# EAGLE design ATTiny84-RFM95W-BME280 (EAGLE 9.5.2)
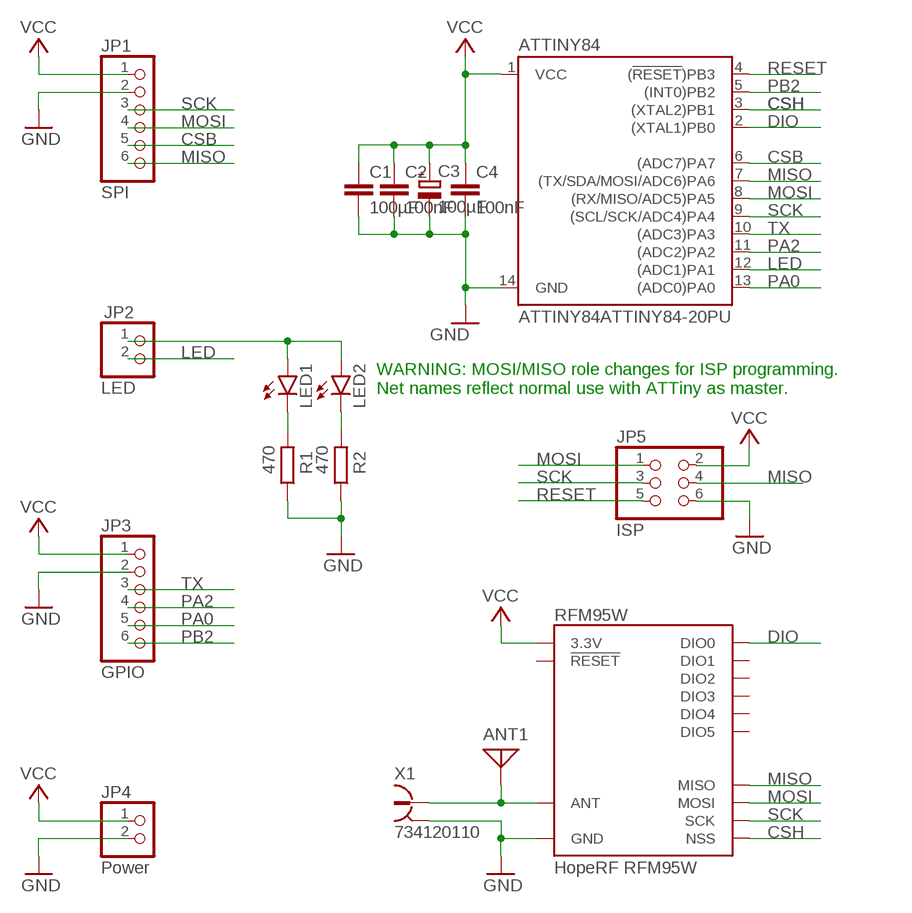
[diagram p0: schematic, sheet 1]

## Parts
ANT1  ANTENNA  [PAD-01]
ATTINY84  ATTINY84ATTINY84-20PU  [DIP14]
C1  100µF  C-EUC0805  [C0805]
C2  100nF  C-EUC0805  [C0805]
C3  100µF  CPOL-EUE2.5-6  [E2,5-6]
C4  100nF  C-EU050-050X075  [C050-050X075]
JP1  SPI  PINHD-1X6  [1X06]
JP2  LED  PINHD-1X2  [1X02]
JP3  GPIO  PINHD-1X6  [1X06]
JP4  Power  PINHD-1X2  [1X02]
JP5  ISP  PINHD-2X3  [2X03]
LED1  LEDCHIP-LED0805  [CHIP-LED0805]
LED2  LED3MM  [LED3MM]
R1  470  R-EU_R0805  [R0805]
R2  470  R-EU_0207/12  [0207/12]
RFM95W  RFM95W  [RFM95/96/97/98W]
X1  734120110  [734120110]

## Nets
CSB: ATTINY84.6((ADC7)PA7) JP1.5
CSH: ATTINY84.3((XTAL2)PB1) RFM95W.NSS
DIO: ATTINY84.2((XTAL1)PB0) RFM95W.DIO0
GND: ATTINY84.14(GND) C1.2 C2.2 C3.- C4.2 JP1.2 JP3.2 JP4.2 JP5.6 R1.1 R2.1 RFM95W.GND@1(GND) RFM95W.GND@2(GND) RFM95W.GND@3(GND) X1.S@1 X1.S@2 X1.S@3
LED: ATTINY84.12((ADC1)PA1) JP2.2
MISO: ATTINY84.7((TX/SDA/MOSI/ADC6)PA6) JP1.6 JP5.4 RFM95W.MISO
MOSI: ATTINY84.8((RX/MISO/ADC5)PA5) JP1.4 JP5.1 RFM95W.MOSI
N$1: ANT1.1 RFM95W.ANT X1.1
N$3: LED1.C R1.2
N$4: LED2.K(C) R2.2
N$7: JP2.1 LED1.A LED2.A
PA0: ATTINY84.13((ADC0)PA0) JP3.5
PA2: ATTINY84.11((ADC2)PA2) JP3.4
PB2: ATTINY84.5((INT0)PB2) JP3.6
RESET: ATTINY84.4((!RESET!)PB3) JP5.5
SCK: ATTINY84.9((SCL/SCK/ADC4)PA4) JP1.3 JP5.3 RFM95W.SCK
TX: ATTINY84.10((ADC3)PA3) JP3.3
VCC: ATTINY84.1(VCC) C1.1 C2.1 C3.+ C4.1 JP1.1 JP3.1 JP4.1 JP5.2 RFM95W.3.3V
Unconnected: RFM95W.!RESET RFM95W.DIO1 RFM95W.DIO2 RFM95W.DIO3 RFM95W.DIO4 RFM95W.DIO5

## Notes on the sheet
- WARNING: MOSI/MISO role changes for ISP programming. 
  Net names reflect normal use with ATTiny as master.

## Library data of the parts
ANT1 = discrete:ANTENNA: Antenna
ATTINY84 = SparkFun-IC-Microcontroller:ATTINY84: Atmel 14-pin 2/4/8kB flash uC Datasheet <https://cdn.sparkfun.com/datasheets/Widgets/doc8006.pdf> SparkFun Products Tiny AVR Programmer <https://www.sparkfun.com/products/11801> (PGM-11801) SparkFun Servo Trigger - Continuous Rotation <https://www.sparkfun.com/products/13872> (WIG-13872) SparkFun Servo Trigger <https://www.sparkfun.com/products/13118> (WIG-13118)
C1 C2 C4 = rcl:C-EU: CAPACITOR, European symbol; SPICEPREFIX: C
C3 = rcl:CPOL-EU: POLARIZED CAPACITOR, European symbol; SPICEPREFIX: C
JP1 JP3 = pinhead:PINHD-1X6: PIN HEADER
JP2 JP4 = pinhead:PINHD-1X2: PIN HEADER
JP5 = pinhead:PINHD-2X3: PIN HEADER
LED1 LED2 = led:LED: LED OSRAM: - CHIPLED LG R971, LG N971, LY N971, LG Q971, LY Q971, LO R971, LY R971 LH N974, LH R974 LS Q976, LO Q976, LY Q976 LO Q996 - Hyper CHIPLED LW Q18S LB Q993, LB Q99A, LB R99A - SideLED LS A670, LO A670, LY A670, LG A670, LP A670 LB A673, LV A673, LT A673, LW A673 LH A674 LY A675 LS A676, LA A676, LO A676, LY A676, LW A676 LS A679, LY A679, LG A679 - Hyper Micro SIDELED® LS Y876, LA Y876, LO Y876, LY Y876 LT Y87S - SmartLED LW L88C, LW L88S LB L89C, LB L89S, LG L890 LS L89K, LO L89K, LY L89K LS L896, LA L896, LO L896, LY L896 - TOPLED LS T670, LO T670, LY T670, LG T670, LP T670 LSG T670, LSP T670, LSY T670, LOP T670, LYG T670 LG T671, LOG T671, LSG T671 LB T673, LV T673, LT T673, LW T673 LH T674 LS T676, LA T676, LO T676, LY T676, LB T676, LH T676, LSB T676, LW T676 LB T67C, LV T67C, LT T67C, LS T67K, LO T67K, LY T67K, LW E67C LS E67B, LA E67B, LO E67B, LY E67B, LB E67C, LV E67C, LT E67C LW T67C LS T679, LY T679, LG T679 LS T770, LO T770, LY T770, LG T770, LP T770 LB T773, LV T773, LT T773, LW T773 LH T774 LS E675, LA E675, LY E675, LS T675 LS T776, LA T776, LO T776, LY T776, LB T776 LHGB T686 LT T68C, LB T68C - Hyper Mini TOPLED® LB M676 - Mini TOPLED Santana® LG M470 LS M47K, LO M47K, LY M47K Source: http://www.osram.convergy.de LUXEON: - LUMILED® LXK2-PW12-R00, LXK2-PW12-S00, LXK2-PW14-U00, LXK2-PW14-V00 LXK2-PM12-R00, LXK2-PM12-S00, LXK2-PM14-U00 LXK2-PE12-Q00, LXK2-PE12-R00, LXK2-PE12-S00, LXK2-PE14-T00, LXK2-PE14-U00 LXK2-PB12-K00, LXK2-PB12-L00, LXK2-PB12-M00, LXK2-PB14-N00, LXK2-PB14-P00, LXK2-PB14-Q00 LXK2-PR12-L00, LXK2-PR12-M00, LXK2-PR14-Q00, LXK2-PR14-R00 LXK2-PD12-Q00, LXK2-PD12-R00, LXK2-PD12-S00 LXK2-PH12-R00, LXK2-PH12-S00 LXK2-PL12-P00, LXK2-PL12-Q00, LXK2-PL12-R00 Source: www.luxeon.com KINGBRIGHT: KA-3528ASYC Source: www.kingbright.com
R1 R2 = rcl:R-EU_: RESISTOR, European symbol; SPICEPREFIX: R
RFM95W = SparkFun-RF:RFM95W: RFM95/96/97/98 The RFM95/96/97/98(W) transceivers feature the LoRaTM long range modem that provides ultra-long range spread spectrum communication and high interference immunity whilst minimising current consumption. These devices also support high performance (G)FSK modes for systems including WMBus, IEEE802.15.4g. The RFM95/96/97/98(W) deliver exceptional phase noise, selectivity, receiver linearity and IIP3 for significantly lower current consumption than competing devices Datasheet <http://www.hoperf.com/upload/rf/RFM95_96_97_98W.pdf>; PROD_ID: IC-13959; PROD_NAME: HopeRF RFM95W
X1 = con-coax:734120110: MICRO COAXIAL CONNECTOR RECEPTACLE VERTICAL Source: Data sheet <http://www.molex.com/pdm_docs/sd/734120110_sd.pdf>

## Board
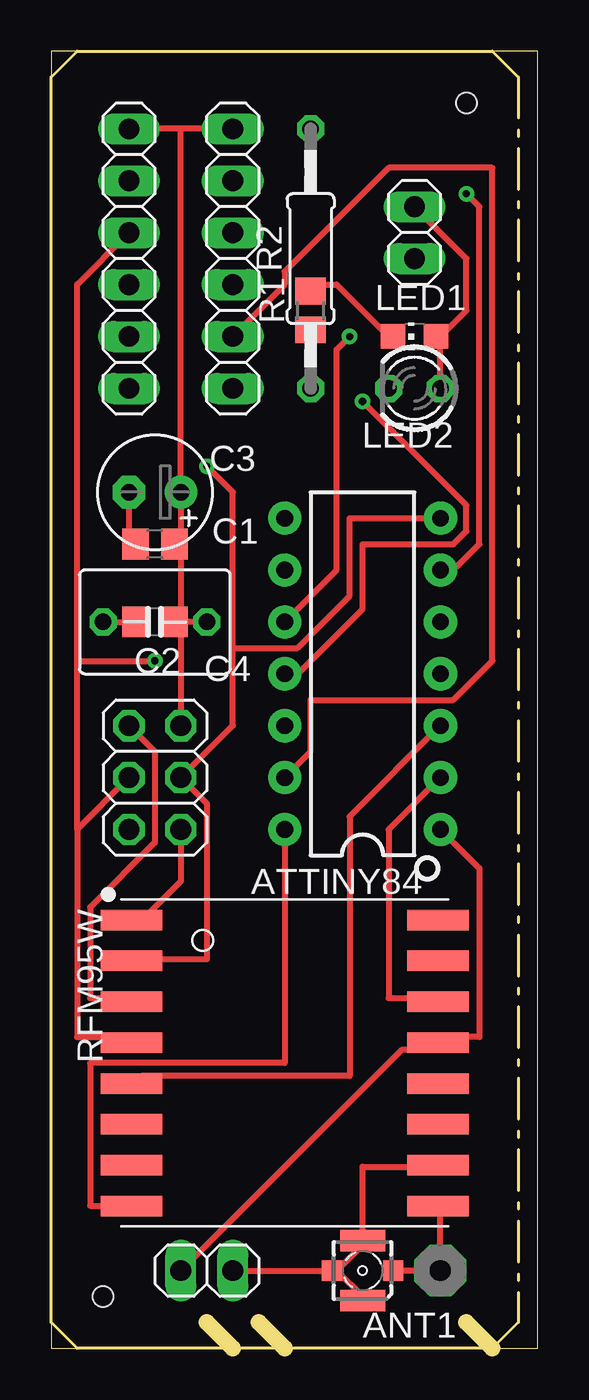
[diagram p1: board, top side]
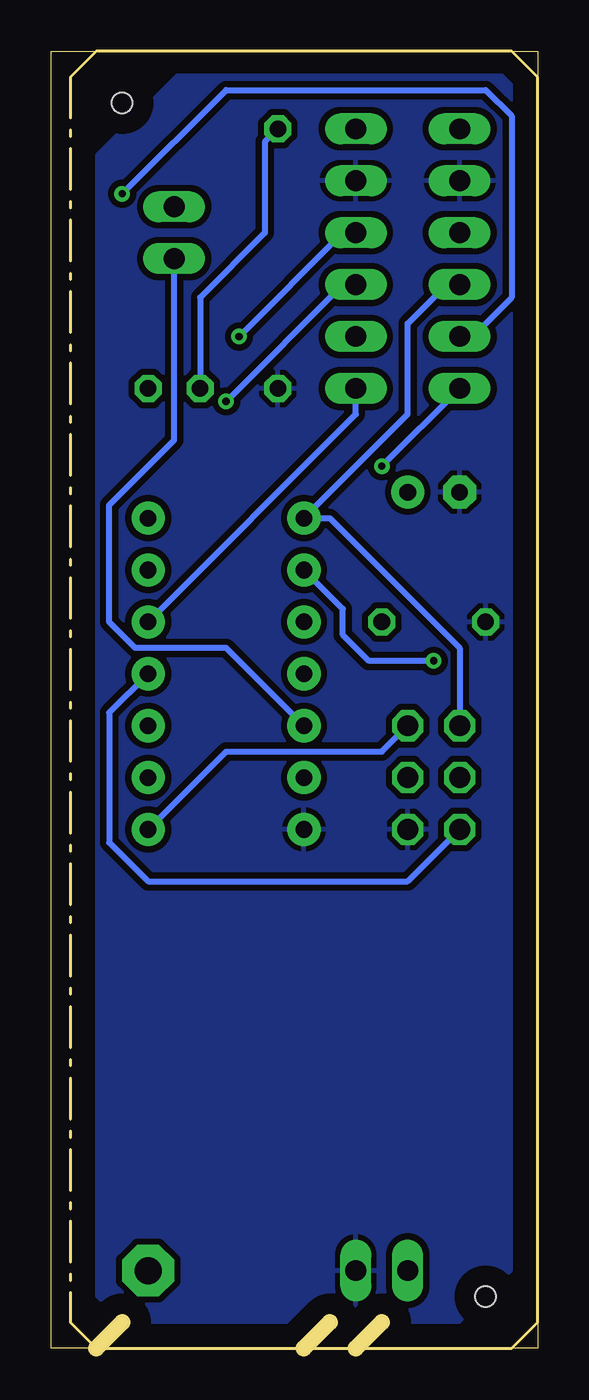
[diagram p2: board, bottom side, seen from below]

Size 23.8 x 63.5 mm. Coordinates in mm from the lower left corner, seen from the top.
Outline: 1.27,0 0,0 0,1.27
Outline: 1.27,0 8.89,0
Outline: 8.89,0 11.43,0
Outline: 11.43,0 21.59,0
Outline: 21.59,0 23.8,0 23.8,63.49 0,63.49 0,62.23
Outline: 7.62,1.27 8.89,0
Outline: 10.16,1.27 11.43,0
Outline: 20.32,1.27 21.59,0
Outline: 21.59,0 22.86,1.27 22.86,62.23 21.59,63.5 1.27,63.5 0,62.23
Outline: 21.59,0 1.27,0
Outline: 1.27,0 0,1.27
Outline: 0,1.27 0,62.23
Copper layers (1*16): Top 0.035mm / dielectric 1.5mm / Bottom 0.035mm
Design rules "default *": minimum track width 12mil, minimum drill 0.35mm, track to track 12mil, track to pad 12mil, pad to pad 12mil, via to via 12mil, smd to smd 6mil, copper to edge 40mil, drill to drill 6mil, minimum pad ring 10mil, minimum via ring 8mil, stop-mask expansion 4mil, vias tented up to drill 0mil, thermal gap 10mil
Holes 1 mm at 2.54,2.54 20.32,60.96

### Footprints (pad centres in the part's own frame; a part is rotated, then mirrored left to right if it is on the bottom)
PAD-01 = drill 1.321 pad 2.54 octagon: 1 0,0
DIP14 = drill 0.813 pad 1.626: 1 -7.62,-3.81; 2 -5.08,-3.81; 3 -2.54,-3.81; 4 0,-3.81; 5 2.54,-3.81; 6 5.08,-3.81; 7 7.62,-3.81; 8 7.62,3.81; 9 5.08,3.81; 10 2.54,3.81; 11 0,3.81; 12 -2.54,3.81; 13 -5.08,3.81; 14 -7.62,3.81
C0805 = smd 1.3 x 1.5: 1 -0.95,0; 2 0.95,0
E2,5-6 = drill 0.813 pad 1.6: + -1.27,0 | drill 0.813 pad 1.6 octagon: - 1.27,0
C050-050X075 = drill 0.813 octagon: 1 -2.54,0; 2 2.54,0
1X06 = drill 1.016 long: 1 -6.35,0; 2 -3.81,0; 3 -1.27,0; 4 1.27,0; 5 3.81,0; 6 6.35,0
1X02 = drill 1.016 long: 1 -1.27,0; 2 1.27,0
2X03 = drill 1.016 octagon: 1 -2.54,-1.27; 2 -2.54,1.27; 3 0,-1.27; 4 0,1.27; 5 2.54,-1.27; 6 2.54,1.27
CHIP-LED0805 = smd 1.2 x 1.2: A 0,-1.05; C 0,1.05
LED3MM = drill 0.813 octagon: A -1.27,0; K 1.27,0
R0805 = smd 1.3 x 1.5: 1 -0.95,0; 2 0.95,0
0207/12 = drill 0.813 octagon: 1 -6.35,0; 2 6.35,0
RFM95/96/97/98W = smd 3 x 1: 3.3V 7.5,1; !RESET -7.5,-3; ANT 7.5,-7; DIO0 7.5,3; DIO1 7.5,5; DIO2 7.5,7; DIO3 7.5,-3; DIO4 7.5,-1; DIO5 -7.5,-5; GND@1 -7.5,7; GND@2 -7.5,-7; GND@3 7.5,-5; MISO -7.5,5; MOSI -7.5,3; NSS -7.5,-1; SCK -7.5,1
734120110 = smd 1 x 1: 1 0,-1.5; S@1 0,1.5 | smd 1.05 x 2.2: S@2 -1.475,0; S@3 1.475,0

### Placement (x,y rotation side)
ANT1  19.05,3.81 0 top
ATTINY84  15.24,33.02 90 top
C1  5.08,39.37 180 top
C2  5.08,35.56 180 top
C3  5.08,41.91 180 top
C4  5.08,35.56 180 top
JP1  3.81,53.34 270 top
JP2  17.78,54.61 270 top
JP3  8.89,53.34 270 top
JP4  7.62,3.81 0 top
JP5  5.08,27.94 270 top
LED1  17.78,49.53 90 top
LED2  17.78,46.99 180 top
R1  12.7,50.8 90 top
R2  12.7,53.34 90 top
RFM95W  11.43,13.97 0 top
X1  15.24,3.81 90 top

### Tracks (layer width: path | path; a pad name or v marks a point on that pad's centre or on a via)
CSB  (via drill 0.35)
  Top 0.305: v20.32,56.52 20.95,55.88 20.95,39.37 19.68,38.1 ATTINY84.6
  Bottom 0.305: JP1.5 3.17,49.53 1.27,51.44 1.27,60.33 2.54,61.59 15.24,61.59 v20.32,56.52
CSH
  Top 0.305: ATTINY84.3 14.61,26.04 14.61,13.34 4.45,13.34 RFM95W.NSS
DIO
  Top 0.305: ATTINY84.2 16.51,25.4 16.51,17.14 18.41,17.14 RFM95W.DIO0
GND
  Top 0.305: 13.97,3.81 15.24,5.08 X1.S@3 15.24,8.89 18.41,8.89 RFM95W.GND@3 | 13.97,3.81 15.24,2.54 X1.S@2 | 13.97,3.81 X1.S@1 JP4.2 | C4.2 C2.2 | C3.- 3.81,39.37 C1.2 | R2.1 R1.1 | ATTINY84.14 11.43,13.97 1.91,13.97 1.91,6.99 3.81,6.99 RFM95W.GND@2 | JP5.6 6.35,22.86 4.45,20.95 RFM95W.GND@1
  pour Bottom: 1.27,63.5 16.51,63.5 21.59,58.42 21.59,2.54 20.32,1.27 3.81,1.27 1.27,3.81
LED
  Bottom 0.305: JP2.2 17.78,44.45 20.95,41.27 20.95,35.56 19.68,34.29 15.24,34.29 ATTINY84.12
MISO  (via drill 0.35)
  Top 0.305: RFM95W.MISO 4.45,19.05 7.62,19.05 7.62,26.67 JP5.4 8.89,30.48 8.89,34.29 | v7.62,43.18 8.89,41.91 8.89,34.29 | ATTINY84.7 14.61,40.64 14.61,36.83 12.06,34.29 8.89,34.29
  Bottom 0.305: v7.62,43.18 JP1.6
MOSI
  Top 0.305: JP5.1 5.08,29.21 5.08,24.77 1.91,21.59 1.91,17.14 3.81,17.14 RFM95W.MOSI
  Bottom 0.305: JP1.4 4.45,52.07 6.35,50.16 6.35,45.72 ATTINY84.8 10.16,40.64 3.81,34.29 JP5.1
N$1
  Top 0.305: X1.1 ANT1.1 19.05,6.99 RFM95W.ANT
N$3
  Top 0.305: LED1.C 16.51,49.53 13.97,52.07 12.7,52.07 R1.2
N$4
  Bottom 0.305: LED2.K 16.51,51.44 13.34,54.61 13.34,59.05 R2.2
N$7
  Top 0.305: LED2.A 19.05,49.53 | JP2.1 20.32,53.34 20.32,50.8 19.05,49.53 | 19.05,49.53 LED1.A
PA0
  Top 0.305: JP3.5 11.43,52.07 11.43,52.7 16.51,57.78 21.59,57.78 21.59,33.66 19.68,31.75 12.7,31.75 12.7,29.21 ATTINY84.13
PA2  (via drill 0.35)
  Top 0.305: v15.24,46.35 20.32,41.27 20.32,40.01 19.68,39.37 15.24,39.37 15.24,36.2 12.06,33.02 ATTINY84.11
  Bottom 0.305: JP3.4 9.53,52.07 v15.24,46.35
PB2
  Bottom 0.305: JP3.6 8.89,45.72 ATTINY84.5
RESET
  Bottom 0.305: JP5.5 6.35,22.86 19.05,22.86 20.95,24.77 20.95,31.11 ATTINY84.4
SCK  (via drill 0.35)
  Top 0.305: 1.27,25.4 1.27,15.24 3.81,15.24 RFM95W.SCK | JP5.3 1.27,25.4 | JP1.3 1.27,52.07 1.27,33.66 | 1.27,25.4 1.27,33.66 | 1.27,33.66 v5.08,33.66
  Bottom 0.305: ATTINY84.9 9.53,36.2 9.53,34.92 8.26,33.66 v5.08,33.66
TX  (via drill 0.35)
  Top 0.305: v14.61,49.53 13.97,48.9 13.97,38.1 ATTINY84.10
  Bottom 0.305: JP3.3 9.53,54.61 v14.61,49.53
VCC
  Top 0.305: JP3.1 6.35,59.69 | 6.35,59.69 JP1.1 | C4.1 6.35,35.56 | 6.35,39.37 C3.+ 6.35,59.69 | 6.35,39.37 6.35,35.56 | 6.35,39.37 C1.1 | 6.35,35.56 JP5.2 | 6.35,35.56 C2.1 | ATTINY84.1 20.95,23.5 20.95,15.24 19.05,15.24 RFM95W.3.3V 18.41,14.61 17.14,14.61 JP4.1
  Bottom 0.305: JP5.2 7.62,29.21 15.24,29.21 ATTINY84.1

### Text on the board
tNames: RFM95W
tValues: ° | ° | MISO CSB MOSI SCK GND VCC | PB2 PA0 PA2 TX GND VCC | ° | MI Vcc / / CL MO / / Rst Gd | (c) Joachim Banzhaf 2020, 1.8-3.6V, <10µA sleep, <100mA tx | 3V3 | Gnd